# Altium schematic sheet SOURCE_POWER.SchDoc
size A3; SheetNumber: 5; SheetTotal: 12
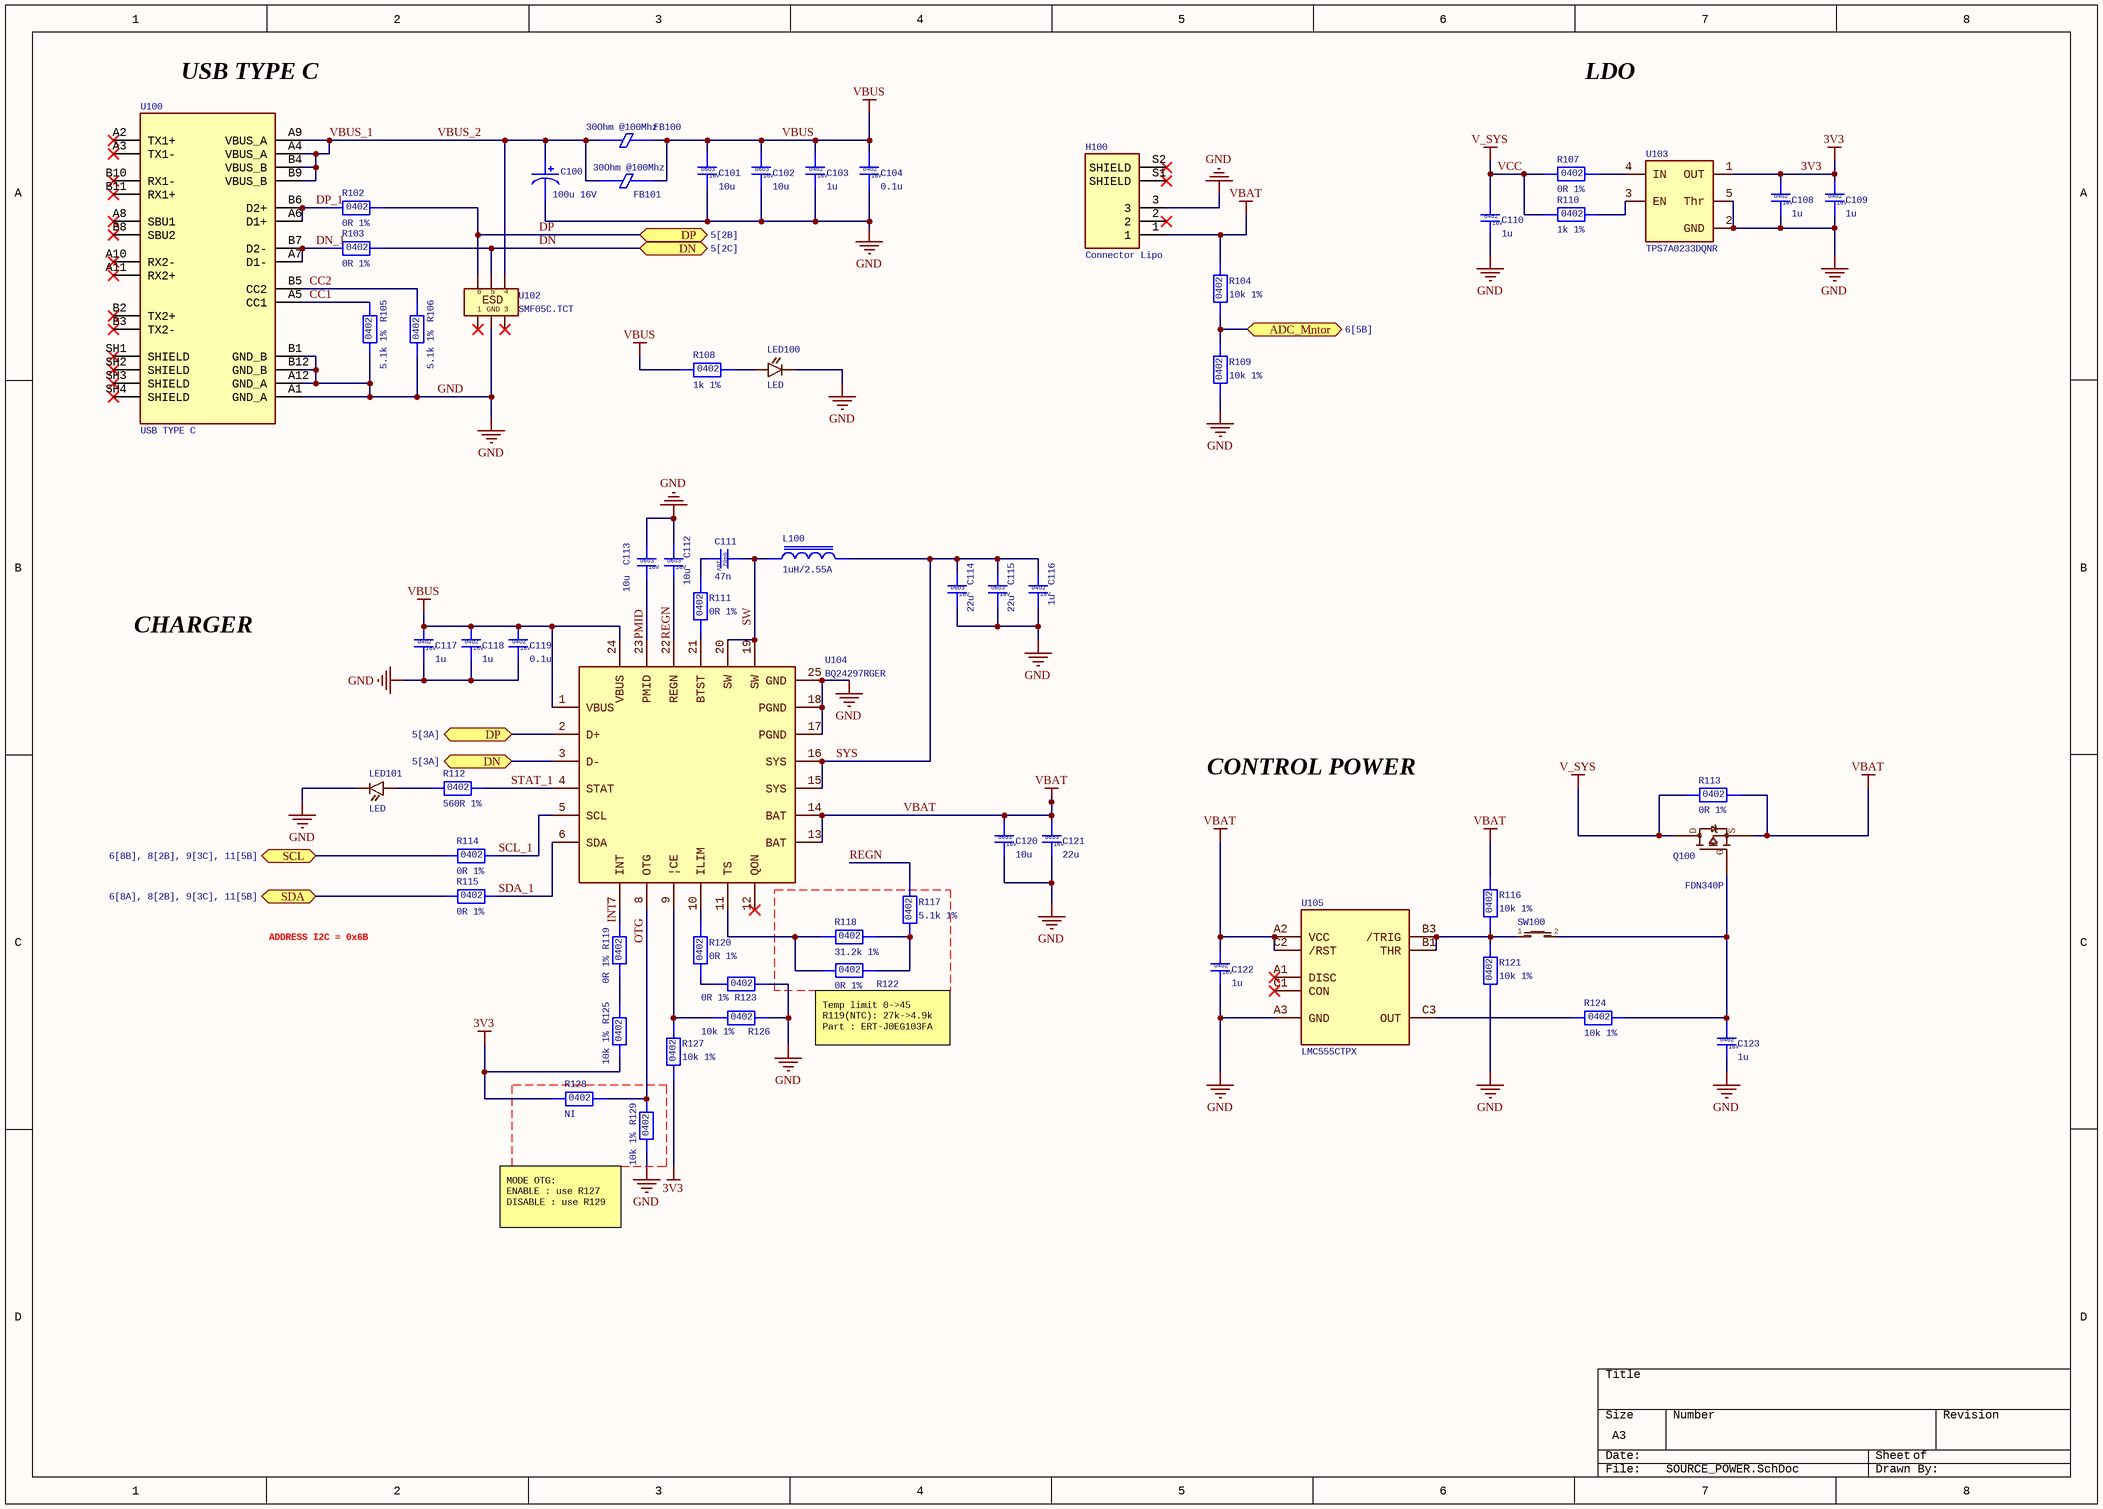
[diagram p0: SOURCE_POWER.SchDoc]

## Parts
C100  100u 16V  [T491C107K016AT]
C101  10u  [CAP0603]
C102  10u  [CAP0603]
C103  1u  [CAP0402]
C104  0.1u  [CAP0402]
C108  1u  [CAP0402]
C109  1u  [CAP0402]
C110  1u  [CAP0402]
C111  47n  [CAP0402]
C112  10u  [CAP0603]
C113  10u  [CAP0603]
C114  22u  [CAP0603]
C115  22u  [CAP0603]
C116  1u  [CAP0402]
C117  1u  [CAP0402]
C118  1u  [CAP0402]
C119  0.1u  [CAP0402]
C120  10u  [CAP0603]
C121  22u  [CAP0603]
C122  1u  [CAP0402]
C123  1u  [CAP0402]
FB100  30Ohm @100Mhz  [FB0402]
FB101  30Ohm @100Mhz  [FB0402]
H100  Connector Lipo  [CON]
L100  1uH/2.55A  [VLS2012ET-1R0N-CA]
LED100  LED  [LED0402]
LED101  LED  [LED0402]
Q100  FDN340P  [FDN340P]
R102  0R 1%  [RES0402]
R103  0R 1%  [RES0402]
R104  10k 1%  [R0402]
R105  5.1k 1%  [RES0402]
R106  5.1k 1%  [RES0402]
R107  0R 1%  [RES0402]
R108  1k 1%  [RES0402]
R109  10k 1%  [R0402]
R110  1k 1%  [RES0402]
R111  0R 1%  [RES0402]
R112  560R 1%  [R0402]
R113  0R 1%  [RES0402]
R114  0R 1%  [RES0402]
R115  0R 1%  [RES0402]
R116  10k 1%  [R0402]
R117  5.1k 1%  [RES0402]
R118  31.2k 1%  [RES0402]
R119  0R 1%  [RES0402]
R120  0R 1%  [RES0402]
R121  10k 1%  [R0402]
R122  0R 1%  [RES0402]
R123  0R 1%  [RES0402]
R124  10k 1%  [R0402]
R125  10k 1%  [R0402]
R126  10k 1%  [R0402]
R127  10k 1%  [R0402]
R128  NI  [RES0402]
R129  10k 1%  [R0402]
SW100  SW  [434331013822]  (value not drawn)
U100  USB TYPE C  [12401826E412A]
U102  SMF05C.TCT  [SMF05C.TCT]
U103  TPS7A0233DQNR  [TPS7A0218PDQNR]
U104  BQ24297RGER  [BQ24297RGER]
U105  LMC555CTPX  [LMC555CTPX/NOPB]

## Ports
ADC_Mntor (bidir, see 6[5B]), DN (bidir, see 5[2C]), DN (bidir, see 5[3A]), DP (bidir, see 5[2B]), DP (bidir, see 5[3A]), SCL (bidir, see 6[8B], 8[2B], 9[3C], 11[5B]), SDA (bidir, see 6[8A], 8[2B], 9[3C], 11[5B])

## Nets
3V3: C108.1 C109.1 R125.1 R127.1 R128.1 U103.1(OUT)
GND: C100.C C101.2 C102.2 C103.2 C104.2 C108.2 C109.2 C110.2 C112.1 C113.1 C114.2 C115.2 C116.2 C117.2 C118.2 C119.2 C120.2 C121.2 C122.2 C123.2 H100.3 LED100.1(C) LED101.1(C) R105.1 R106.1 R109.1 R121.1 R123.2 R126.2 R129.1 U100.A1(GND_A) U100.A12(GND_A) U100.B1(GND_B) U100.B12(GND_B) U102.2 U103.2(GND) U103.5(Thr) U104.17(PGND) U104.18(PGND) U104.25(GND) U105.A3(GND)
VBAT: C120.1 C121.1 C122.1 H100.1 Q100.2(S) R104.2 R113.2 R116.2 U104.13(BAT) U104.14(BAT) U105.A2(VCC) U105.C2(/RST)
VBUS: C101.1 C102.1 C103.1 C104.1 C117.1 C118.1 C119.1 FB100.2 FB101.2 R108.1 U104.1(VBUS) U104.24(VBUS)
VCC: C110.1 Q100.3(D) R107.1 R110.1 R113.1  [also labelled V_SYS]
ADC_Mntor: R104.1 R109.2 ; port ADC_Mntor
CC1: R105.2 U100.A5(CC1)
CC2: R106.2 U100.B5(CC2)
DN: R103.2 U102.5 U104.3(D-) ; port DN
DN_1: R103.1 U100.A7(D1-) U100.B7(D2-)
DP: R102.2 U102.6 U104.2(D+) ; port DP
DP_1: R102.1 U100.A6(D1+) U100.B6(D2+)
INT: R119.2 U104.7(INT)
OTG: R128.2 R129.2 U104.8(OTG)
PMID: C113.2 U104.23(PMID)
REGN: C112.2 R117.2 U104.22(REGN)
SCL: R114.1 ; port SCL
SCL_1: R114.2 U104.5(SCL)
SDA: R115.1 ; port SDA
SDA_1: R115.2 U104.6(SDA)
STAT_1: R112.2 U104.4(STAT)
SW: C111.1 L100.1 U104.19(SW) U104.20(SW)
SYS: C114.1 C115.1 C116.1 L100.2 U104.15(SYS) U104.16(SYS)
VBUS_1: C100.A FB100.1 FB101.1 U100.A4(VBUS_A) U100.A9(VBUS_A) U100.B4(VBUS_B) U100.B9(VBUS_B) U102.4  [also labelled VBUS_2]
NetC111_2: C111.2 R111.2
NetC123_1: C123.1 Q100.1(G) R124.2 SW100.2
NetLED100_2: LED100.2(A) R108.2
NetLED101_2: LED101.2(A) R112.1
NetR107_2: R107.2 U103.4(IN)
NetR110_2: R110.2 U103.3(EN)
NetR111_1: R111.1 U104.21(BTST)
NetR116_1: R116.1 R121.2 SW100.1 U105.B1(THR) U105.B3(/TRIG)
NetR117_1: R117.1 R118.2 R122.2
NetR118_1: R118.1 R122.1 U104.11(TS)
NetR119_1: R119.1 R125.2
NetR120_1: R120.1 R123.1
NetR120_2: R120.2 U104.10(ILIM)
NetR124_1: R124.1 U105.C3(OUT)
NetR126_1: R126.1 R127.2 U104.9(|CE)

Not connected (* = marked no-connect by the designer): H100 2* S1(SHIELD)* S2(SHIELD)*; U100 A2(TX1+)* A3(TX1-)* A8(SBU1)* A10(RX2-)* A11(RX2+)* B2(TX2+)* B3(TX2-)* B8(SBU2)* B10(RX1-)* B11(RX1+)* SH1(SHIELD)* SH2(SHIELD)* SH3(SHIELD)* SH4(SHIELD)*; U102 1* 3*; U104 12(QON)*; U105 A1(DISC)* C1(CON)*

## Notes on the sheet
- USB TYPE C
- LDO
- CHARGER
- CONTROL POWER
- ADDRESS I2C = 0x6B
- (near R122) Temp limit 0->45
  R119(NTC): 27k->4.9k
  Part : ERT-J0EG103FA
- (near R129) MODE OTG:
  ENABLE : use R127
  DISABLE : use R129
- (in symbol R_0402_31.2k) 0402
- (in symbol SMF05C.TCT) ESD; GND

## Library data of the parts
C100 = T491C107K016AT: Tantalum Capacitor, Polarized, Tantalum (dry/solid), 16V, 10% +Tol, 10% -Tol, 100uF, Surface Mount, 2413; Manufacturer: KEMET; ESR (Equivalent Series Resistance): 1R; Leakage Current: 16uA; Ripple Current: 132.8mA; Tan Delta: 0.1; Supplier 1: Digikey; Supplier Part Number 1: 399-5214-1-ND; Supplier: Digikey; Supplier Part Number: 399-5214-1-ND; Manufacturer Part Number: T491C107K016AT; RoHS: Yes; Category: Tantalum Capacitors; Stock: 21248; Pricing: 1=1.86, 10=1.393, 50=1.271, 100=1.0412 (USD); Mounting Technology: Surface Mount; Pins: 2; Terminal Finish: Tin; Dielectric Material: Tantalum; Case/Package: 2413; Package Shape: Rectangular; Min Operating Temperature: -55°C; Max Operating Temperature: 125°C; JESD-609 Code: e3; Package Style: SMTMeter; Packaging: Tape and Reel; Polarity: Polarized; Value: 100uF; Capacitor Type: Tantalum; Tolerance  (fill in as +-): 10%; Tolerance (fill in as +-): 10%; Rated DC Voltage (URdc): 16V; Termination: J BEND; Length: 6mm; Width: 3.2mm; Height: 2.5mm; Reach SVHC Compliant: Yes; RoHS Compliant: Yes; ComponentLink1URL: https://datasheet.ciiva.com:443/pdfs/VipMasterIC/IC/KEME/KEME-S-A0009553711/KEME-S-A0009553711-1.pdf?src-supplier=IHS+Markit; ComponentLink1Description: https://datasheet.ciiva.com:443/pdfs/VipMasterIC/IC/KEME/KEME-S-A0009553711/KEME-S-A0009553711-1.pdf?src-supplier=IHS+Markit; ComponentLink2URL: https://datasheet.ciiva.com/12887/kem-t2005-t491-12887095.pdf?src-supplier=Mouser; ComponentLink2Description: https://datasheet.ciiva.com/12887/kem-t2005-t491-12887095.pdf?src-supplier=Mouser; ComponentLink3URL: https://datasheet.ciiva.com/46417/1854511-46417622.pdf?src-supplier=Element14; ComponentLink3Description: https://datasheet.ciiva.com/46417/1854511-46417622.pdf?src-supplier=Element14; ComponentLink4URL: https://datasheet.ciiva.com/46417/1854511-46417623.pdf?src-supplier=Element14; ComponentLink4Description: https://datasheet.ciiva.com/46417/1854511-46417623.pdf?src-supplier=Element14; ComponentLink5URL: https://datasheet.ciiva.com/46417/1854511-46417624.pdf?src-supplier=Element14; ComponentLink5Description: https://datasheet.ciiva.com/46417/1854511-46417624.pdf?src-supplier=Element14; ComponentLink6URL: https://datasheet.ciiva.com/7614/kem-t2005-t491-7614509.pdf?src-supplier=Digikey; ComponentLink6Description: https://datasheet.ciiva.com/7614/kem-t2005-t491-7614509.pdf?src-supplier=Digikey; ComponentLink7URL: https://datasheet.ciiva.com/7614/kem-t2005-t491-7614510.pdf?src-supplier=Digikey; ComponentLink7Description: https://datasheet.ciiva.com/7614/kem-t2005-t491-7614510.pdf?src-supplier=Digikey; ComponentLink8URL: https://datasheet.ciiva.com/7614/kem-t2005-t491-7614511.pdf?src-supplier=Digikey; ComponentLink8Description: https://datasheet.ciiva.com/7614/kem-t2005-t491-7614511.pdf?src-supplier=Digikey
C101 C102 C112 C113 C120 = C_0402_10u: Ceramic Capacitor, Multilayer, Ceramic, 16V, 20% +Tol, 20% -Tol, X5R, 15% TC, 10uF, Surface Mount, 0603; Manufacturer: Murata; Manufacturer Part Number: GRT188R61C106ME13D; Multilayer: Yes; Reference Standard: AEC-Q200; Supplier: Digikey; Supplier Part Number: 490-12318-1-ND; RoHS: Yes; Category: Ceramic Capacitors; Stock: 232325; Pricing: 1=0.24, 10=0.158, 50=0.1162, 100=0.0947, 500=0.07476, 1000=0.06313 (USD); Mounting Technology: Surface Mount; Pins: 2; Dielectric Material: Ceramic; Package Shape: Rectangular; Case/Package: 0603; Terminal Finish: Nickel; Min Operating Temperature: -55°C; Max Operating Temperature: 85°C; JESD-609 Code: e3; Value: 10uF; Capacitor Type: Ceramic; Tolerance  (fill in as +-): 20%; Packaging: Tape and Reel; Tolerance (fill in as +-): 20%; Rated DC Voltage (URdc): 16V; Temperature Characteristics Code: X5R; Termination: Wraparound; Reach SVHC Compliant: Yes; RoHS Compliant: Yes; ComponentLink1URL: https://datasheet.ciiva.com:443/pdfs/VipMasterIC/IC/MURE/MURE-S-A0004410517/MURE-S-A0004413840-1.pdf?src-supplier=IHS+Markit; ComponentLink1Description: https://datasheet.ciiva.com:443/pdfs/VipMasterIC/IC/MURE/MURE-S-A0004410517/MURE-S-A0004413840-1.pdf?src-supplier=IHS+Markit; ComponentLink2URL: http://search.murata.co.jp/Ceramy/image/img/A01X/G101/ENG/GRT188R61C106ME13-01.pdf?src-supplier=Digikey; ComponentLink2Description: http://search.murata.co.jp/Ceramy/image/img/A01X/G101/ENG/GRT188R61C106ME13-01.pdf?src-supplier=Digikey
C103 C108-C110 C116-C118 C122 C123 = C_0402_1u: Ceramic Capacitor, Multilayer, Ceramic, 16V, 10% +Tol, 10% -Tol, X5R, 15% TC, 1uF, Surface Mount, 0402; Manufacturer: Taiyo Yuden; Manufacturer Part Number: EMK105BJ105KV-F; Multilayer: Yes; Supplier: Digikey; Supplier Part Number: 587-2477-1-ND; RoHS: Yes; Category: Ceramic Capacitors; Stock: 2709915; Pricing: 1=0.1, 10=0.045, 50=0.031, 100=0.0266, 500=0.01912, 1000=0.01682, 2500=0.01437, 5000=0.01289 (USD); Mounting Technology: Surface Mount; Pins: 2; Dielectric Material: Ceramic; Package Shape: Rectangular; Case/Package: 0402; Terminal Finish: Nickel; Min Operating Temperature: -55°C; Max Operating Temperature: 85°C; JESD-609 Code: e3; Value: 1uF; Capacitor Type: Ceramic; Tolerance  (fill in as +-): 10%; Package Style: SMTMeter; Packaging: Tape and Reel; Tolerance (fill in as +-): 10%; Rated DC Voltage (URdc): 16V; Temperature Characteristics Code: X5R; Termination: Wraparound; Length: 1mm; Width: 0.5mm; Height: 0.5mm; Reach SVHC Compliant: Yes; RoHS Compliant: Yes; ComponentLink1URL: https://datasheet.ciiva.com:443/pdfs/VipMasterIC/IC/TAIY/TAIY-S-A0009096450/TAIY-S-A0009096597-1.pdf?src-supplier=IHS+Markit; ComponentLink1Description: https://datasheet.ciiva.com:443/pdfs/VipMasterIC/IC/TAIY/TAIY-S-A0009096450/TAIY-S-A0009096597-1.pdf?src-supplier=IHS+Markit; ComponentLink2URL: https://datasheet.ciiva.com/134/emk105bj105kv-f-ss-134209.pdf?src-supplier=Digikey; ComponentLink2Description: https://datasheet.ciiva.com/134/emk105bj105kv-f-ss-134209.pdf?src-supplier=Digikey; ComponentLink3URL: https://datasheet.ciiva.com/15920/964emk105bj105kv-f-15920402.pdf?src-supplier=Onlinecomponents.com; ComponentLink3Description: https://datasheet.ciiva.com/15920/964emk105bj105kv-f-15920402.pdf?src-supplier=Onlinecomponents.com; ComponentLink4URL: https://datasheet.ciiva.com/26871/getdatasheetpartid-638287-26871289.pdf?src-supplier=Verical; ComponentLink4Description: https://datasheet.ciiva.com/26871/getdatasheetpartid-638287-26871289.pdf?src-supplier=Verical; ComponentLink5URL: https://datasheet.ciiva.com/30259/265emk105bj105kv-f-30259872.pdf?src-supplier=Onlinecomponents.com; ComponentLink5Description: https://datasheet.ciiva.com/30259/265emk105bj105kv-f-30259872.pdf?src-supplier=Onlinecomponents.com; ComponentLink6URL: https://datasheet.ciiva.com/7657/1497285-7657320.pdf?src-supplier=Element14; ComponentLink6Description: https://datasheet.ciiva.com/7657/1497285-7657320.pdf?src-supplier=Element14; ComponentLink7URL: https://datasheet.ciiva.com/22694/1497285-22694239.pdf?src-supplier=Element14; ComponentLink7Description: https://datasheet.ciiva.com/22694/1497285-22694239.pdf?src-supplier=Element14; ComponentLink8URL: https://datasheet.ciiva.com/5424/mlcc01-e-5424190.pdf?src-supplier=Mouser; ComponentLink8Description: https://datasheet.ciiva.com/5424/mlcc01-e-5424190.pdf?src-supplier=Mouser
C104 C119 = C_0402_0.1u: Ceramic Capacitor, Multilayer, Ceramic, 16V, 10% +Tol, 10% -Tol, X7R, 15% TC, 0.1uF, Surface Mount, 0402; Manufacturer: Murata; Manufacturer Part Number: GRM155R71C104KA88J; Value: 100nF; Multilayer: Yes; Supplier: Digikey; Supplier Part Number: 490-6328-1-ND; RoHS: Yes; Category: Ceramic Capacitors; Stock: 19409569; Pricing: 1=0.1, 10=0.019, 50=0.011, 100=0.0086, 500=0.00646, 1000=0.00508, 2500=0.00462, 5000=0.00425 (USD); Mounting Technology: Surface Mount; Pins: 2; Dielectric Material: Ceramic; Package Shape: Rectangular; Case/Package: 0402; Terminal Finish: Nickel; Min Operating Temperature: -55°C; Max Operating Temperature: 125°C; JESD-609 Code: e3; Capacitor Type: Ceramic; Tolerance  (fill in as +-): 10%; Package Style: SMTMeter; Packaging: Tape and Reel; Tolerance (fill in as +-): 10%; Rated DC Voltage (URdc): 16V; Temperature Characteristics Code: X7R; Termination: Wraparound; Length: 1mm; Width: 0.5mm; Height: 0.5mm; Reach SVHC Compliant: Yes; RoHS Compliant: Yes; ComponentLink1URL: https://psearch.en.murata.com:443/capacitor/product/GRM155R71C104KA88%23.pdf?src-supplier=IHS+Markit; ComponentLink1Description: https://psearch.en.murata.com:443/capacitor/product/GRM155R71C104KA88%23.pdf?src-supplier=IHS+Markit; ComponentLink2URL: https://datasheet.ciiva.com/6271/product-6271168.pdf?src-supplier=Digikey; ComponentLink2Description: https://datasheet.ciiva.com/6271/product-6271168.pdf?src-supplier=Digikey; ComponentLink3URL: https://datasheet.ciiva.com/6271/grm155r71c104ka88-01-6271231.pdf?src-supplier=Digikey; ComponentLink3Description: https://datasheet.ciiva.com/6271/grm155r71c104ka88-01-6271231.pdf?src-supplier=Digikey
C111 = C_0402_47n: Ceramic Capacitor, Multilayer, Ceramic, 16V, 10% +Tol, 10% -Tol, X7R, 15% TC, 0.047uF, Surface Mount, 0402; Manufacturer: Murata; Manufacturer Part Number: GCM155R71C473KA37D; Value: 47nF; Multilayer: Yes; Reference Standard: AEC-Q200; Supplier: Digikey; Supplier Part Number: 490-6042-1-ND; RoHS: Yes; Category: Ceramic Capacitors; Stock: 703056; Pricing: 1=0.1, 10=0.031, 50=0.018, 100=0.0139, 500=0.01046, 1000=0.00821, 2500=0.00747, 5000=0.00687 (USD); Mounting Technology: Surface Mount; Pins: 2; Dielectric Material: Ceramic; Package Shape: Rectangular; Case/Package: 0402; Terminal Finish: Nickel; Min Operating Temperature: -55°C; Max Operating Temperature: 125°C; JESD-609 Code: e3; Capacitor Type: Ceramic; Tolerance  (fill in as +-): 10%; Package Style: SMTMeter; Packaging: Tape and Reel; Tolerance (fill in as +-): 10%; Rated DC Voltage (URdc): 16V; Temperature Characteristics Code: X7R; Termination: Wraparound; Length: 1mm; Width: 0.5mm; Height: 0.55mm; Reach SVHC Compliant: Yes; RoHS Compliant: Yes; ComponentLink1URL: https://datasheet.ciiva.com:443/pdfs/VipMasterIC/IC/MURE/MURE-S-A0004370842/MURE-S-A0004373024-1.pdf?src-supplier=IHS+Markit; ComponentLink1Description: https://datasheet.ciiva.com:443/pdfs/VipMasterIC/IC/MURE/MURE-S-A0004370842/MURE-S-A0004373024-1.pdf?src-supplier=IHS+Markit; ComponentLink2URL: https://datasheet.ciiva.com/11607/product-11607786.pdf?src-supplier=Avnet; ComponentLink2Description: https://datasheet.ciiva.com/11607/product-11607786.pdf?src-supplier=Avnet; ComponentLink3URL: https://datasheet.ciiva.com/6270/s0717e-6270764.pdf?src-supplier=Digikey; ComponentLink3Description: https://datasheet.ciiva.com/6270/s0717e-6270764.pdf?src-supplier=Digikey; ComponentLink4URL: https://datasheet.ciiva.com/6270/s0717e-6270765.pdf?src-supplier=Digikey; ComponentLink4Description: https://datasheet.ciiva.com/6270/s0717e-6270765.pdf?src-supplier=Digikey; ComponentLink5URL: https://datasheet.ciiva.com/6270/s0717e-6270766.pdf?src-supplier=Digikey; ComponentLink5Description: https://datasheet.ciiva.com/6270/s0717e-6270766.pdf?src-supplier=Digikey
C114 C115 C121 = C_0402_22u: Ceramic Capacitor, Multilayer, Ceramic, 16V, 20% +Tol, 20% -Tol, X5R, 15% TC, 22uF, Surface Mount, 0603; Manufacturer: Samsung; Manufacturer Part Number: CL10A226MO7JZNC; Multilayer: Yes; Supplier: Digikey; Supplier Part Number: 1276-7076-1-ND; RoHS: Yes; Category: Ceramic Capacitors; Stock: 1046811; Pricing: 1=0.59, 10=0.398, 50=0.3164, 100=0.2614, 500=0.20418, 1000=0.17355, 4000=0.15314, 8000=0.14293, 12000=0.14038, 28000=0.13782 (USD); Mounting Technology: Surface Mount; Pins: 2; Dielectric Material: Ceramic; Package Shape: Rectangular; Case/Package: 0603; Min Operating Temperature: -55°C; Max Operating Temperature: 85°C; Value: 22uF; Capacitor Type: Ceramic; Tolerance  (fill in as +-): 20%; Packaging: Tape and Reel; Tolerance (fill in as +-): 20%; Rated DC Voltage (URdc): 16V; Temperature Characteristics Code: X5R; Termination: Wraparound; Reach SVHC Compliant: Yes; RoHS Compliant: Yes; ComponentLink1URL: https://datasheet.ciiva.com:443/pdfs/VipMasterIC/IC/SEMS/SEMS-S-A0008524842/SEMS-S-A0008524715-1.pdf?src-supplier=IHS+Markit; ComponentLink1Description: https://datasheet.ciiva.com:443/pdfs/VipMasterIC/IC/SEMS/SEMS-S-A0008524842/SEMS-S-A0008524715-1.pdf?src-supplier=IHS+Markit; ComponentLink2URL: http://www.samsungsem.com/kr/support/product-search/mlcc/CL10A226MO7JZNC.jsp?src-supplier=Digikey; ComponentLink2Description: http://www.samsungsem.com/kr/support/product-search/mlcc/CL10A226MO7JZNC.jsp?src-supplier=Digikey; ComponentLink3URL: https://datasheet.octopart.com/CL10A226MO7JZNC-Samsung-Electro-Mechanics-datasheet-149156497.pdf?src-supplier=Future+Electronics; ComponentLink3Description: https://datasheet.octopart.com/CL10A226MO7JZNC-Samsung-Electro-Mechanics-datasheet-149156497.pdf?src-supplier=Future+Electronics
FB100 FB101 = BLM15PD300SN1D: Ferrite Chip, 1 Function(s), 1.4A, 2 Pin(s); Manufacturer: Murata; DC Resistance-Max: 35mR; Clock Frequency: 100MHz; Channels: 1; Output Impedance: 30R; Supplier 1: Digikey; Supplier Part Number 1: 490-5200-1-ND; Supplier: Digikey; Supplier Part Number: 490-5200-6-ND; Manufacturer Part Number: BLM15PD300SN1D; RoHS: Yes; Category: Ferrite Beads and Chips; Stock: 1685; Pricing: 1=0.1, 10=0.054, 25=0.0468, 50=0.042, 100=0.0376, 250=0.03236, 500=0.02884, 1000=0.02561, 5000=0.01905 (USD); Mounting Technology: Surface Mount; Material: Ferrite; Case Code: 0402; Terminal Finish: Tin; Min Operating Temperature: -55°C; Max Operating Temperature: 125°C; JESD-609 Code: e3; Construction: Chip Bead; Filter Type: FERRITE CHIP; Min Frequency: 100MHz; Packaging: Tape and Reel; Current Rating: 1.4A; Length: 1mm; Width: 0.5mm; Height: 0.5mm; Reach SVHC Compliant: Yes; RoHS Compliant: Yes; ComponentLink1URL: https://datasheet.ciiva.com:443/pdfs/VipMasterIC/IC/MURE/MURE-S-A0010009827/MURE-S-A0010009827-1.pdf?src-supplier=IHS+Markit; ComponentLink1Description: https://datasheet.ciiva.com:443/pdfs/VipMasterIC/IC/MURE/MURE-S-A0010009827/MURE-S-A0010009827-1.pdf?src-supplier=IHS+Markit; ComponentLink2URL: https://datasheet.ciiva.com/3854/l0110s0100blm15p-3854117.pdf?src-supplier=Arrow+Electronics; ComponentLink2Description: https://datasheet.ciiva.com/3854/l0110s0100blm15p-3854117.pdf?src-supplier=Arrow+Electronics; ComponentLink3URL: https://datasheet.ciiva.com/18093/getdatasheetpartid-150173-18093043.pdf?src-supplier=Verical; ComponentLink3Description: https://datasheet.ciiva.com/18093/getdatasheetpartid-150173-18093043.pdf?src-supplier=Verical; ComponentLink4URL: https://datasheet.ciiva.com/41425/001171687-da-01-en-chip-drossel0402-30r-2200ma-1-0x0-5mm-41425790.pdf?src-supplier=Conrad; ComponentLink4Description: https://datasheet.ciiva.com/41425/001171687-da-01-en-chip-drossel0402-30r-2200ma-1-0x0-5mm-41425790.pdf?src-supplier=Conrad; ComponentLink5URL: https://datasheet.ciiva.com/41449/001172206-da-01-en-drossel-0402-30r-21-0x0-5mm-10000st-41449493.pdf?src-supplier=Conrad; ComponentLink5Description: https://datasheet.ciiva.com/41449/001172206-da-01-en-drossel-0402-30r-21-0x0-5mm-10000st-41449493.pdf?src-supplier=Conrad; ComponentLink6URL: https://datasheet.ciiva.com/14122/blm-series-eng-tds-14122923.pdf?src-supplier=Distrelec; ComponentLink6Description: https://datasheet.ciiva.com/14122/blm-series-eng-tds-14122923.pdf?src-supplier=Distrelec; ComponentLink7URL: https://datasheet.ciiva.com/1012/l0110e-1012431.pdf?src-supplier=Digikey; ComponentLink7Description: https://datasheet.ciiva.com/1012/l0110e-1012431.pdf?src-supplier=Digikey; ComponentLink8URL: https://datasheet.ciiva.com/1012/l0110e-1012432.pdf?src-supplier=Digikey; ComponentLink8Description: https://datasheet.ciiva.com/1012/l0110e-1012432.pdf?src-supplier=Digikey; ComponentLink9URL: https://datasheet.ciiva.com/1012/l0110e-1012433.pdf?src-supplier=Digikey; ComponentLink9Description: https://datasheet.ciiva.com/1012/l0110e-1012433.pdf?src-supplier=Digikey
H100 = Connector Lipo: CONN HEADER SH 3POS SIDE 1MM TIN; Manufacturer: JST; Manufacturer Part Number: SM03B-SRSS-TB(LF)(SN); Supplier: Farnell; Supplier Part Number: 1679118; RoHS: Yes; Category: Connectors; Stock: 153704; Pricing: 10=0.261, 100=0.194, 500=0.167, 1000=0.148, 2500=0.14, 5000=0.131 (GBP); ComponentLink1URL: https://datasheet.ciiva.com/26894/getdatasheetpartid-708885-26894671.pdf?src-supplier=Verical; ComponentLink1Description: https://datasheet.ciiva.com/26894/getdatasheetpartid-708885-26894671.pdf?src-supplier=Verical; ComponentLink2URL: https://datasheet.ciiva.com/16394/sm03b-srss-tblfsn-16394332.pdf?src-supplier=Future+Electronics; ComponentLink2Description: https://datasheet.ciiva.com/16394/sm03b-srss-tblfsn-16394332.pdf?src-supplier=Future+Electronics; ComponentLink3URL: https://datasheet.ciiva.com/8052/91630-8052263.pdf?src-supplier=Element14; ComponentLink3Description: https://datasheet.ciiva.com/8052/91630-8052263.pdf?src-supplier=Element14
L100 = VLS2012ET-1R0N-CA: FIXED IND 1UH 1.65A 86 MOHM SMD; Supplier 1: Digikey; Supplier Part Number 1: 445-172980-1-ND
LED100 LED101 = LED0402: Single Color LED, Hyper Red, Water Clear, 0.8mm; Manufacturer: Kingbright; Manufacturer Part Number: APHHS1005SURCK; Shape: Rectangular; Forward Current: 30mA; Luminous Intensity-Nom: 140mcd; Channels: 1; Viewing Angle: 120°; Forward Voltage: 2.5V; Reverse Voltage-Max: 5V; Overall Height: 0.5mm; Supplier: Digikey; Supplier Part Number: 754-1104-1-ND; RoHS: Yes; Category: LEDs; Stock: 73220; Pricing: 1=0.47, 10=0.31, 100=0.2068, 500=0.14302, 1000=0.11918 (USD); Mounting Technology: Surface Mount; Pins: 2; Color: Red; Color@wavelength: Red; Min Operating Temperature: -40°C; Max Operating Temperature: 85°C; Lens Style: WATER CLEAR; Optoelectronic Device Type: SINGLE COLOR LED; Packaging: Tape and Reel; Size: 0.8mm; Terminal Pitch: 1.1mm; Reach SVHC Compliant: Yes; RoHS Compliant: Yes; ComponentLink1URL: https://datasheet.ciiva.com:443/pdfs/VipMasterIC/IC/KBEC/KBEC-S-A0008947180/KBEC-S-A0008958151-1.pdf?src-supplier=IHS+Markit; ComponentLink1Description: https://datasheet.ciiva.com:443/pdfs/VipMasterIC/IC/KBEC/KBEC-S-A0008947180/KBEC-S-A0008958151-1.pdf?src-supplier=IHS+Markit; ComponentLink2URL: https://datasheet.ciiva.com/4689/aphhs1005surck-32322-4689068.pdf?src-supplier=Mouser; ComponentLink2Description: https://datasheet.ciiva.com/4689/aphhs1005surck-32322-4689068.pdf?src-supplier=Mouser; ComponentLink3URL: https://datasheet.ciiva.com/2114/aphhs1005surck-2114140.pdf?src-supplier=Digikey; ComponentLink3Description: https://datasheet.ciiva.com/2114/aphhs1005surck-2114140.pdf?src-supplier=Digikey; ComponentLink4URL: https://datasheet.ciiva.com/14603/70062833-14603899.pdf?src-supplier=Allied+Electronics; ComponentLink4Description: https://datasheet.ciiva.com/14603/70062833-14603899.pdf?src-supplier=Allied+Electronics; ComponentLink5URL: https://datasheet.ciiva.com/2114/aphhs1005surck-2114141.pdf?src-supplier=Digikey; ComponentLink5Description: https://datasheet.ciiva.com/2114/aphhs1005surck-2114141.pdf?src-supplier=Digikey; ComponentLink6URL: https://datasheet.ciiva.com/2114/aphhs1005surck-2114142.pdf?src-supplier=Digikey; ComponentLink6Description: https://datasheet.ciiva.com/2114/aphhs1005surck-2114142.pdf?src-supplier=Digikey
Q100 = FDN340P: Small Signal Field-Effect Transistor, 2A I(D), 20V, 1-Element, P-Channel, Silicon, Metal-oxide Semiconductor FET; Manufacturer: ON Semiconductor / Fairchild; Package Body Material: Plastic; Number of Elements: 1; Drain-source On Resistance-Max: 70R; Operating Mode: ENHANCEMENT MODE; Power Dissipation-Max (Abs): 500mW; Transistor Application: SWITCHING; Qualification Status: Not Qualified; Supplier 1: Digikey; Supplier Part Number 1: FDN340PCT-ND; Supplier: Digikey; Supplier Part Number: FDN340PCT-ND; Manufacturer Part Number: FDN340P; RoHS: Yes; Category: MOSFETs; Stock: 82276; Pricing: 1=0.46, 10=0.355, 100=0.213, 500=0.1972, 1000=0.1341, 3000=0.12345, 6000=0.11832, 9000=0.10649, 30000=0.10491, 75000=0.0986 (USD); Pins: 3; Package Shape: Rectangular; Transistor Element Material: SILICON; Terminal Finish: Tin; Max Operating Temperature: 150°C; JESD-30 Code: R-PDSO-G3; Moisture Sensitivity Level: 1; Package Style: SMALL OUTLINEMeter; Surface Mount: Yes; Terminal Form: Gull Wing; Terminal Position: DUAL; Polarity/Channel Type: P-CHANNEL; Drain Current-Max (Abs) (ID): 2A; Drain Current-Max (ID): 2A; DS Breakdown Voltage-Min: 20V; FET Technology: METAL-OXIDE SEMICONDUCTOR; JESD-609 Code: e3; Reach SVHC Compliant: Yes; RoHS Compliant: Yes; ComponentLink1URL: https://datasheet.ciiva.com:443/pdfs/VipMasterIC/IC/ONSM/ONSM-S-A0003584711/ONSM-S-A0003584686-1.pdf?src-supplier=IHS+Markit; ComponentLink1Description: https://datasheet.ciiva.com:443/pdfs/VipMasterIC/IC/ONSM/ONSM-S-A0003584711/ONSM-S-A0003584686-1.pdf?src-supplier=IHS+Markit
R102 R103 R107 R111 R113-R115 R119 R120 R122 R123 = R_0402_0R: Metal Glaze/thick Film, 0.0625W, 0ohm, Surface Mount, 0402; Manufacturer: Yageo; Manufacturer Part Number: RC0402JR-070RL; Power: 62.5mW; Rated Temperature: 70°C; Package Height: 0.35mm; Package Length: 1mm; Package Width: 0.5mm; Supplier 1: Digikey; Supplier Part Number 1: 311-0.0JRTR-ND; Supplier: Digikey; Supplier Part Number: 311-0.0JRCT-ND; RoHS: Yes; Category: Chip SMD Resistors; Stock: 14877447; Pricing: 1=0.1, 10=0.011, 25=0.0084, 50=0.0064, 100=0.0045, 250=0.00364, 500=0.0029, 1000=0.00214, 5000=0.00154, 10000=0.00133, 30000=0.00117, 50000=0.00107, 100000=0.00105 (USD); Mounting Technology: Surface Mount; Pins: 2; Package Shape: Rectangular; Case/Package: 0402; Terminal Finish: Nickel; Min Operating Temperature: -55°C; Max Operating Temperature: 155°C; JESD-609 Code: e3; Resistor Type: FIXED RESISTOR; Packaging: Tape and Reel; Value: 0R; Technology: METAL GLAZE/THICK FILM; Termination: Wraparound; Construction: Chip; Package Style: SMTMeter; Reach SVHC Compliant: Yes; RoHS Compliant: Yes; ComponentLink1URL: https://datasheet.ciiva.com:443/pdfs/VipMasterIC/IC/YAGO/YAGO-S-A0008145938/YAGO-S-A0008145938-1.pdf?src-supplier=IHS+Markit; ComponentLink1Description: https://datasheet.ciiva.com:443/pdfs/VipMasterIC/IC/YAGO/YAGO-S-A0008145938/YAGO-S-A0008145938-1.pdf?src-supplier=IHS+Markit; ComponentLink2URL: https://datasheet.ciiva.com/2452/pyu-rc0402-51-rohs-l-6-2452608.pdf?src-supplier=Digikey; ComponentLink2Description: https://datasheet.ciiva.com/2452/pyu-rc0402-51-rohs-l-6-2452608.pdf?src-supplier=Digikey; ComponentLink3URL: https://datasheet.ciiva.com/11808/0900766b80c66297-11808195.pdf?src-supplier=Rs; ComponentLink3Description: https://datasheet.ciiva.com/11808/0900766b80c66297-11808195.pdf?src-supplier=Rs; ComponentLink4URL: https://datasheet.ciiva.com/7983/1018594-7983535.pdf?src-supplier=Element14; ComponentLink4Description: https://datasheet.ciiva.com/7983/1018594-7983535.pdf?src-supplier=Element14; ComponentLink5URL: https://datasheet.ciiva.com/22747/1018594-22747515.pdf?src-supplier=Element14; ComponentLink5Description: https://datasheet.ciiva.com/22747/1018594-22747515.pdf?src-supplier=Element14; ComponentLink6URL: https://datasheet.ciiva.com/2452/pyu-r-int-thick-7-2452609.pdf?src-supplier=Digikey; ComponentLink6Description: https://datasheet.ciiva.com/2452/pyu-r-int-thick-7-2452609.pdf?src-supplier=Digikey; ComponentLink7URL: https://datasheet.ciiva.com/2452/pyu-r-int-thick-7-2452610.pdf?src-supplier=Digikey; ComponentLink7Description: https://datasheet.ciiva.com/2452/pyu-r-int-thick-7-2452610.pdf?src-supplier=Digikey; ComponentLink8URL: https://datasheet.ciiva.com/8896/pyu-rc0402-51-rohs-l-6-8896201.pdf?src-supplier=Avnet; ComponentLink8Description: https://datasheet.ciiva.com/8896/pyu-rc0402-51-rohs-l-6-8896201.pdf?src-supplier=Avnet
R104 R109 R116 R121 R124-R127 R129 = R_0402_10k: Fixed Resistor, Metal Glaze/thick Film, 0.06W, 10000ohm, 50V, 1% +/-Tol, 100ppm/Cel, Surface Mount, 0402; Manufacturer: Samsung; Manufacturer Part Number: RC1005F103CS; Power: 60mW; Value: 10kR; Temperature Coefficient: 100ppm/°C; Package Height: 0.35mm; Package Length: 1mm; Package Width: 0.5mm; Supplier: Digikey; Supplier Part Number: 1276-3431-1-ND; RoHS: Yes; Category: Chip SMD Resistors; Stock: 14343795; Pricing: 1=0.1, 10=0.024, 50=0.0156, 100=0.0132, 500=0.00922, 1000=0.00803, 5000=0.00598, 10000=0.00533, 20000=0.00481, 30000=0.00458 (USD); Mounting Technology: Surface Mount; Pins: 2; Package Shape: Rectangular; Case/Package: 0402; Terminal Finish: Nickel; Min Operating Temperature: -55°C; Max Operating Temperature: 125°C; Tolerance: 1%; JESD-609 Code: e3; Resistor Type: FIXED RESISTOR; Construction: Chip; Package Style: SMTMeter; Packaging: Tape and Reel; Technology: METAL GLAZE/THICK FILM; Working Voltage: 50V; Reach SVHC Compliant: Yes; RoHS Compliant: Yes; ComponentLink1URL: https://datasheet.ciiva.com:443/pdfs/VipMasterIC/IC/SEMS/SEMS-S-A0001326806/SEMS-S-A0001326806-1.pdf?src-supplier=IHS+Markit; ComponentLink1Description: https://datasheet.ciiva.com:443/pdfs/VipMasterIC/IC/SEMS/SEMS-S-A0001326806/SEMS-S-A0001326806-1.pdf?src-supplier=IHS+Markit; ComponentLink2URL: https://datasheet.ciiva.com/15196/getdatasheetpartid-504789-15196214.pdf?src-supplier=Verical; ComponentLink2Description: https://datasheet.ciiva.com/15196/getdatasheetpartid-504789-15196214.pdf?src-supplier=Verical; ComponentLink3URL: https://datasheet.ciiva.com/16481/rcseries-16481007.pdf?src-supplier=Future+Electronics; ComponentLink3Description: https://datasheet.ciiva.com/16481/rcseries-16481007.pdf?src-supplier=Future+Electronics
R105 R106 R117 = R_0402_5.1k: Fixed Resistor, Metal Glaze/thick Film, 0.0625W, 5100ohm, 50V, 1% +/-Tol, 100ppm/Cel, Surface Mount, 0402; Manufacturer: Yageo; Manufacturer Part Number: RC0402FR-075K1L; Additional Feature: LASER TRIMMABLE; Power: 62.5mW; Rated Temperature: 70°C; Value: 5.1kR; Temperature Coefficient: 100ppm/°C; Package Height: 0.35mm; Package Length: 1mm; Package Width: 0.5mm; Supplier: Digikey; Supplier Part Number: 311-5.10KLRCT-ND; RoHS: Yes; Category: Chip SMD Resistors; Stock: 302088; Pricing: 1=0.1, 10=0.015, 50=0.0088, 100=0.0073, 500=0.00488, 1000=0.00417, 5000=0.00297 (USD); Mounting Technology: Surface Mount; Pins: 2; Package Shape: Rectangular; Case/Package: 0402; Terminal Finish: Nickel; Min Operating Temperature: -55°C; Max Operating Temperature: 155°C; Tolerance: 1%; JESD-609 Code: e3; Resistor Type: FIXED RESISTOR; Packaging: Tape and Reel; Technology: METAL GLAZE/THICK FILM; Termination: Wraparound; Working Voltage: 50V; Construction: Chip; Package Style: SMTMeter; Reach SVHC Compliant: Yes; RoHS Compliant: Yes; ComponentLink1URL: https://datasheet.ciiva.com:443/pdfs/VipMasterIC/IC/YAGO/YAGO-S-A0008145938/YAGO-S-A0008145938-1.pdf?src-supplier=IHS+Markit; ComponentLink1Description: https://datasheet.ciiva.com:443/pdfs/VipMasterIC/IC/YAGO/YAGO-S-A0008145938/YAGO-S-A0008145938-1.pdf?src-supplier=IHS+Markit; ComponentLink2URL: https://datasheet.ciiva.com/7983/1018594-7983519.pdf?src-supplier=Element14; ComponentLink2Description: https://datasheet.ciiva.com/7983/1018594-7983519.pdf?src-supplier=Element14; ComponentLink3URL: https://datasheet.ciiva.com/46394/1018594-46394936.pdf?src-supplier=Element14; ComponentLink3Description: https://datasheet.ciiva.com/46394/1018594-46394936.pdf?src-supplier=Element14; ComponentLink4URL: https://datasheet.ciiva.com/2453/pyu-r-int-thick-7-2453401.pdf?src-supplier=Digikey; ComponentLink4Description: https://datasheet.ciiva.com/2453/pyu-r-int-thick-7-2453401.pdf?src-supplier=Digikey; ComponentLink5URL: https://datasheet.ciiva.com/2453/pyu-r-int-thick-7-2453402.pdf?src-supplier=Digikey; ComponentLink5Description: https://datasheet.ciiva.com/2453/pyu-r-int-thick-7-2453402.pdf?src-supplier=Digikey; ComponentLink6URL: https://datasheet.ciiva.com/2453/pyu-r-int-thick-7-2453400.pdf?src-supplier=Digikey; ComponentLink6Description: https://datasheet.ciiva.com/2453/pyu-r-int-thick-7-2453400.pdf?src-supplier=Digikey; ComponentLink7URL: https://datasheet.ciiva.com/12558/pyu-rc0402-51-rohs-l-6-r-8721-12558460.pdf?src-supplier=Mouser; ComponentLink7Description: https://datasheet.ciiva.com/12558/pyu-rc0402-51-rohs-l-6-r-8721-12558460.pdf?src-supplier=Mouser; ComponentLink8URL: https://datasheet.ciiva.com/16744/pyu-rc0402-51-rohs-l-6-r-16744283.pdf?src-supplier=Future+Electronics; ComponentLink8Description: https://datasheet.ciiva.com/16744/pyu-rc0402-51-rohs-l-6-r-16744283.pdf?src-supplier=Future+Electronics; ComponentLink9URL: https://datasheet.ciiva.com/15189/getdatasheetpartid-323636-15189493.pdf?src-supplier=Verical; ComponentLink9Description: https://datasheet.ciiva.com/15189/getdatasheetpartid-323636-15189493.pdf?src-supplier=Verical
R108 R110 = R_0402_1k: Fixed Resistor, Metal Glaze/thick Film, 0.1W, 1000ohm, 75V, 1% +/-Tol, 100ppm/Cel, Surface Mount, 0402; Manufacturer: KOA Speer; Manufacturer Part Number: RK73H1ETTP1001F; Additional Feature: PRECISION; Power: 100mW; Rated Temperature: 70°C; Value: 1kR; Temperature Coefficient: 100ppm/°C; Working Voltage: 50V; Package Height: 0.35mm; Package Length: 1mm; Package Width: 0.5mm; Reference Standard: AEC-Q200; Supplier 1: Digikey; Supplier Part Number 1: 311-1.00KLRDKR-ND; Supplier: Digikey; Supplier Part Number: 2019-RK73H1ETTP1001FCT-ND; RoHS: Yes; Category: Chip SMD Resistors; Stock: 1041060; Pricing: 1=0.1, 10=0.021, 50=0.0134, 100=0.0112, 500=0.00764, 1000=0.00658, 5000=0.00478 (USD); Mounting Technology: Surface Mount; Pins: 2; Case/Package: 0402; Terminal Finish: Nickel; Min Operating Temperature: -55°C; Max Operating Temperature: 155°C; Tolerance: 1%; JESD-609 Code: e3; Resistor Type: FIXED RESISTOR; Construction: Rectangular; Package Style: SMTMeter; Packaging: Tape and Reel; Technology: METAL GLAZE/THICK FILM; Termination: Wraparound; Reach SVHC Compliant: Yes; RoHS Compliant: Yes; ComponentLink1URL: https://datasheet.ciiva.com:443/pdfs/VipMasterIC/IC/KOAS/KOAS-S-A0009586304/KOAS-S-A0009586304-1.pdf?src-supplier=IHS+Markit; ComponentLink1Description: https://datasheet.ciiva.com:443/pdfs/VipMasterIC/IC/KOAS/KOAS-S-A0009586304/KOAS-S-A0009586304-1.pdf?src-supplier=IHS+Markit; ComponentLink2URL: https://datasheet.ciiva.com/5554/rk73h-5554172.pdf?src-supplier=Mouser; ComponentLink2Description: https://datasheet.ciiva.com/5554/rk73h-5554172.pdf?src-supplier=Mouser
R112 = R_0402_560R: Fixed Resistor, Metal Glaze/thick Film, 0.1W, 560ohm, 75V, 1% +/-Tol, 100ppm/Cel, Surface Mount, 0402; Manufacturer: KOA Speer; Manufacturer Part Number: RK73H1ETTP5600F; Additional Feature: PRECISION; Power: 100mW; Rated Temperature: 70°C; Temperature Coefficient: 100ppm/°C; Working Voltage: 50V; Package Height: 0.35mm; Package Length: 1mm; Package Width: 0.5mm; Reference Standard: AEC-Q200; Supplier: Digikey; Supplier Part Number: 2019-RK73H1ETTP5600FCT-ND; RoHS: Yes; Category: Chip SMD Resistors; Stock: 65205; Pricing: 1=0.1, 10=0.021, 50=0.0134, 100=0.0112, 500=0.00764, 1000=0.00658, 5000=0.00478 (USD); Mounting Technology: Surface Mount; Pins: 2; Case/Package: 0402; Terminal Finish: Nickel; Min Operating Temperature: -55°C; Max Operating Temperature: 155°C; Tolerance: 1%; JESD-609 Code: e3; Resistor Type: FIXED RESISTOR; Construction: Rectangular; Package Style: SMTMeter; Packaging: Tape and Reel; Value: 560R; Technology: METAL GLAZE/THICK FILM; Termination: Wraparound; Reach SVHC Compliant: Yes; RoHS Compliant: Yes; ComponentLink1URL: https://datasheet.ciiva.com:443/pdfs/VipMasterIC/IC/KOAS/KOAS-S-A0009586304/KOAS-S-A0009586304-1.pdf?src-supplier=IHS+Markit; ComponentLink1Description: https://datasheet.ciiva.com:443/pdfs/VipMasterIC/IC/KOAS/KOAS-S-A0009586304/KOAS-S-A0009586304-1.pdf?src-supplier=IHS+Markit; ComponentLink2URL: https://datasheet.ciiva.com/5557/rk73h-5557917.pdf?src-supplier=Mouser; ComponentLink2Description: https://datasheet.ciiva.com/5557/rk73h-5557917.pdf?src-supplier=Mouser
R118 = R_0402_31.2k: Fixed Resistor, Thin Film, 0.063W, 31200ohm, 50V, 1% +/-Tol, 25ppm/Cel, Surface Mount, 0402; Manufacturer: KOA Speer; Manufacturer Part Number: RN73H1ETTP3122F25; Supplier: Digikey; Supplier Part Number: 2019-RN73H1ETTP3122F25CT-ND; RoHS: Yes; Category: Resistors; Stock: 29267; Pricing: 1=0.25, 10=0.187, 50=0.1462, 100=0.1304, 500=0.09846, 1000=0.08675, 5000=0.0639 (USD); ComponentLink1URL: https://datasheet.ciiva.com:443/pdfs/VipMasterIC/IC/KOAS/KOAS-S-A0009586296/KOAS-S-A0009586296-1.pdf?src-supplier=IHS+Markit; ComponentLink1Description: https://datasheet.ciiva.com:443/pdfs/VipMasterIC/IC/KOAS/KOAS-S-A0009586296/KOAS-S-A0009586296-1.pdf?src-supplier=IHS+Markit; ComponentLink2URL: https://datasheet.ciiva.com/12737/rn73h-12737573.pdf?src-supplier=Mouser; ComponentLink2Description: https://datasheet.ciiva.com/12737/rn73h-12737573.pdf?src-supplier=Mouser
R128 = R_0402_0R: Metal Glaze/thick Film, 0.0625W, 0ohm, Surface Mount, 0402; Manufacturer: Yageo; Manufacturer Part Number: RC0402JR-070RL; Power: 62.5mW; Rated Temperature: 70°C; Value: 0R; Package Height: 0.35mm; Package Length: 1mm; Package Width: 0.5mm; Supplier 1: Digikey; Supplier Part Number 1: 311-0.0JRTR-ND; Supplier: Digikey; Supplier Part Number: 311-0.0JRCT-ND; RoHS: Yes; Category: Chip SMD Resistors; Stock: 14877447; Pricing: 1=0.1, 10=0.011, 25=0.0084, 50=0.0064, 100=0.0045, 250=0.00364, 500=0.0029, 1000=0.00214, 5000=0.00154, 10000=0.00133, 30000=0.00117, 50000=0.00107, 100000=0.00105 (USD); Mounting Technology: Surface Mount; Pins: 2; Package Shape: Rectangular; Case/Package: 0402; Terminal Finish: Nickel; Min Operating Temperature: -55°C; Max Operating Temperature: 155°C; JESD-609 Code: e3; Resistor Type: FIXED RESISTOR; Packaging: Tape and Reel; Technology: METAL GLAZE/THICK FILM; Termination: Wraparound; Construction: Chip; Package Style: SMTMeter; Reach SVHC Compliant: Yes; RoHS Compliant: Yes; ComponentLink1URL: https://datasheet.ciiva.com:443/pdfs/VipMasterIC/IC/YAGO/YAGO-S-A0008145938/YAGO-S-A0008145938-1.pdf?src-supplier=IHS+Markit; ComponentLink1Description: https://datasheet.ciiva.com:443/pdfs/VipMasterIC/IC/YAGO/YAGO-S-A0008145938/YAGO-S-A0008145938-1.pdf?src-supplier=IHS+Markit; ComponentLink2URL: https://datasheet.ciiva.com/2452/pyu-rc0402-51-rohs-l-6-2452608.pdf?src-supplier=Digikey; ComponentLink2Description: https://datasheet.ciiva.com/2452/pyu-rc0402-51-rohs-l-6-2452608.pdf?src-supplier=Digikey; ComponentLink3URL: https://datasheet.ciiva.com/11808/0900766b80c66297-11808195.pdf?src-supplier=Rs; ComponentLink3Description: https://datasheet.ciiva.com/11808/0900766b80c66297-11808195.pdf?src-supplier=Rs; ComponentLink4URL: https://datasheet.ciiva.com/7983/1018594-7983535.pdf?src-supplier=Element14; ComponentLink4Description: https://datasheet.ciiva.com/7983/1018594-7983535.pdf?src-supplier=Element14; ComponentLink5URL: https://datasheet.ciiva.com/22747/1018594-22747515.pdf?src-supplier=Element14; ComponentLink5Description: https://datasheet.ciiva.com/22747/1018594-22747515.pdf?src-supplier=Element14; ComponentLink6URL: https://datasheet.ciiva.com/2452/pyu-r-int-thick-7-2452609.pdf?src-supplier=Digikey; ComponentLink6Description: https://datasheet.ciiva.com/2452/pyu-r-int-thick-7-2452609.pdf?src-supplier=Digikey; ComponentLink7URL: https://datasheet.ciiva.com/2452/pyu-r-int-thick-7-2452610.pdf?src-supplier=Digikey; ComponentLink7Description: https://datasheet.ciiva.com/2452/pyu-r-int-thick-7-2452610.pdf?src-supplier=Digikey; ComponentLink8URL: https://datasheet.ciiva.com/8896/pyu-rc0402-51-rohs-l-6-8896201.pdf?src-supplier=Avnet; ComponentLink8Description: https://datasheet.ciiva.com/8896/pyu-rc0402-51-rohs-l-6-8896201.pdf?src-supplier=Avnet
SW100 = 434331013822: SWITCH TACTILE SPST-NO 0.05A 12V; Supplier 1: Digikey; Supplier Part Number 1: 732-10144-1-ND
U100 = USBC_12401826E412A: USB3.2 GEN2, Type C, Top mount, CH 1.58mm, Dual Row SMT / Tap/Rl RoHS Compliant: Yes; Manufacturer: Amphenol Communications Solutions; Supplier 1: Digikey; Supplier Part Number 1: 12401826E412ACT-ND; Supplier: Digikey; Supplier Part Number: 12401826E412ACT-ND; Manufacturer Part Number: 12401826E412A; RoHS: No; Category: USB Connectors; Stock: 9613; Pricing: 1=2.38, 10=1.813, 25=1.632, 50=1.509, 100=1.3971, 250=1.26484, 500=1.17548 (USD); ComponentLink1URL: https://datasheet.octopart.com/12401826E412A-Amphenol-Communications-Solutions-datasheet-112029729.pdf?src-supplier=Master+Electronics; ComponentLink1Description: https://datasheet.octopart.com/12401826E412A-Amphenol-Communications-Solutions-datasheet-112029729.pdf?src-supplier=Master+Electronics
U102 = SMF05C.TCT: Trans Voltage Suppressor Diode, 100W, 5V V(RWM), Unidirectional, 5 Element, Silicon, MO-203AB; Manufacturer: Semtech; Package Body Material: Plastic; Min Breakdown Voltage: 6V; Clamping Voltage-Max: 12.5V; Number of Elements: 5; Qualification Status: Not Qualified; Supplier 1: Digikey; Supplier Part Number 1: SMF05CCT-ND; Supplier: Digikey; Supplier Part Number: SMF05CCT-ND; Manufacturer Part Number: SMF05C.TCT; RoHS: Yes; Category: TVS Diodes; Stock: 54740; Pricing: 1=0.8, 10=0.689, 100=0.4772, 500=0.39874, 1000=0.33936 (USD); Pins: 6; Diode Element Material: SILICON; Package Shape: Rectangular; Terminal Finish: Tin; Min Operating Temperature: -55°C; Max Operating Temperature: 125°C; JESD-609 Code: e3; Polarity: Unidirectional; Diode Type: TRANS VOLTAGE SUPPRESSOR; JESD-30 Code: R-PDSO-G6; Moisture Sensitivity Level: 1; Non-rep Peak Rev Power Dis-Max: 100W; Package Style: SMALL OUTLINEMeter; Peak Reflow Temperature (Cel): 260°C; Rep Pk Reverse Voltage-Max: 5V; Surface Mount: Yes; Technology: AVALANCHE; Terminal Form: Gull Wing; Terminal Position: DUAL; Reach SVHC Compliant: Yes; RoHS Compliant: Yes; ComponentLink1URL: https://datasheet.ciiva.com:443/pdfs/VipMasterIC/IC/SEMT/SEMT-S-A0000305255/SEMT-S-A0000305255-1.pdf?src-supplier=IHS+Markit; ComponentLink1Description: https://datasheet.ciiva.com:443/pdfs/VipMasterIC/IC/SEMT/SEMT-S-A0000305255/SEMT-S-A0000305255-1.pdf?src-supplier=IHS+Markit; ComponentLink2URL: https://datasheet.ciiva.com/338/smf05c-338385.pdf?src-supplier=Digikey; ComponentLink2Description: https://datasheet.ciiva.com/338/smf05c-338385.pdf?src-supplier=Digikey; ComponentLink3URL: https://datasheet.ciiva.com/18065/getdatasheetpartid-89007-18065142.pdf?src-supplier=Verical; ComponentLink3Description: https://datasheet.ciiva.com/18065/getdatasheetpartid-89007-18065142.pdf?src-supplier=Verical; ComponentLink4URL: https://datasheet.ciiva.com/338/smf05c-338386.pdf?src-supplier=Digikey; ComponentLink4Description: https://datasheet.ciiva.com/338/smf05c-338386.pdf?src-supplier=Digikey; ComponentLink5URL: https://datasheet.ciiva.com/338/smf05c-338387.pdf?src-supplier=Digikey; ComponentLink5Description: https://datasheet.ciiva.com/338/smf05c-338387.pdf?src-supplier=Digikey; ComponentLink6URL: https://datasheet.ciiva.com/16387/smf05c-16387308.pdf?src-supplier=Future+Electronics; ComponentLink6Description: https://datasheet.ciiva.com/16387/smf05c-16387308.pdf?src-supplier=Future+Electronics
U103 = TPS7A0233DQNR: IC REG LINEAR 3V3 200MA 4X2SON; Supplier 1: Mouser; Supplier Part Number 1: 595-TPS7A0233DQNR
U104 = BQ24297RGER: Power Supply Management Circuit, Adjustable, 1 Channel, +6.4V, PQCC24; Manufacturer: Texas Instruments; Package Body Material: Plastic; Adjustable Threshold: Yes; Number of Channels: 1; Package Equivalence Code: LCC24,.16SQ,20; Power Supplies: 3.9/6.2V; Supply Current-Max (Isup): 3A; Max Supply Voltage: 6.2V; Min Supply Voltage: 3.9V; Nominal Supply Voltage: 5V; Qualification Status: Not Qualified; Supplier 1: Digikey; Supplier Part Number 1: 296-46072-1-ND; Supplier: Digikey; Supplier Part Number: 296-46072-1-ND; Manufacturer Part Number: BQ24297RGER; RoHS: Yes; Category: Battery Management; Stock: 17491; Pricing: 1=2.71, 10=2.433, 25=2.3004, 100=1.9937, 250=1.89144, 500=1.8 (USD); Case/Package: HVQCCN; Pins: 24; Package Shape: Square; Terminal Finish: Nickel; Min Operating Temperature: -40°C; Max Operating Temperature: 85°C; JESD-609 Code: e4; Throw Configuration: POWER SUPPLY MANAGEMENT CIRCUIT; Moisture Sensitivity Level: 2; Channels: 1; Package Style: CHIP CARRIER, HEAT SINK/SLUG, VERY THIN PROFILEMeter; Peak Reflow Temperature (Cel): 260°C; Surface Mount: Yes; Terminal Form: No Lead; Terminal Position: QUAD; Length: 4mm; Width: 4mm; Height - Seated (Max): 1mm; Terminal Pitch: 0.5mm; Temperature Grade: INDUSTRIAL; Reach SVHC Compliant: Yes; RoHS Compliant: Yes; ComponentLink1URL: https://www.ti.com:443/lit/ds/symlink/bq24296.pdf?src-supplier=IHS+Markit; ComponentLink1Description: https://www.ti.com:443/lit/ds/symlink/bq24296.pdf?src-supplier=IHS+Markit; ComponentLink2URL: https://datasheet.ciiva.com/30000/bq24296-30000397.pdf?src-supplier=Avnet; ComponentLink2Description: https://datasheet.ciiva.com/30000/bq24296-30000397.pdf?src-supplier=Avnet
U105 = LMC555CTPX/NOPB: 1 Func, 3MHz, CMOS, PBGA8; Manufacturer: TI National Semiconductor; Package Body Material: Plastic; Throw Configuration: PULSE; RECTANGULAR; Channels: 1; Output Frequency-Max: 3GHz; Power Supplies: 1.5/12V; Max Supply Voltage: 12V; Min Supply Voltage: 1.5V; Nominal Supply Voltage: 5V; Time @ Peak Reflow Temperature-Max (s): 40s; Qualification Status: Not Qualified; Supplier 1: Digikey; Supplier Part Number 1: 296-46430-1-ND; Supplier: Digikey; Supplier Part Number: 296-46430-1-ND; Manufacturer Part Number: LMC555CTPX/NOPB; RoHS: Yes; Category: Timers and Oscillators; Stock: 27881; Pricing: 1=1.35, 10=1.204, 25=1.1424, 100=0.9385, 250=0.87728, 500=0.77528, 1000=0.61206 (USD); Case/Package: FBGA; Pins: 8; Package Shape: Rectangular; Terminal Finish: Copper; Min Operating Temperature: -40°C; Max Operating Temperature: 85°C; JESD-609 Code: e1; Moisture Sensitivity Level: 1; Package Style: GRID ARRAY, FINE PITCHMeter; Peak Reflow Temperature (Cel): 260°C; Surface Mount: Yes; Technology: CMOS; Terminal Form: Ball; Terminal Position: BOTTOM; Length: 1.412mm; Width: 1.387mm; Terminal Pitch: 0.5mm; Reach SVHC Compliant: Yes; RoHS Compliant: Yes; Temperature Grade: INDUSTRIAL; ComponentLink1URL: https://datasheet.ciiva.com:443/pdfs/VipMasterIC/IC/NATL/NATLS11844/NATLS11844-1.pdf?src-supplier=IHS+Markit; ComponentLink1Description: https://datasheet.ciiva.com:443/pdfs/VipMasterIC/IC/NATL/NATLS11844/NATLS11844-1.pdf?src-supplier=IHS+Markit; ComponentLink2URL: https://datasheet.ciiva.com/6666/lmc555-6666976.pdf?src-supplier=Digikey; ComponentLink2Description: https://datasheet.ciiva.com/6666/lmc555-6666976.pdf?src-supplier=Digikey; ComponentLink3URL: https://datasheet.ciiva.com/15152/getdatasheetpartid-628891-15152597.pdf?src-supplier=Verical; ComponentLink3Description: https://datasheet.ciiva.com/15152/getdatasheetpartid-628891-15152597.pdf?src-supplier=Verical; ComponentLink4URL: https://datasheet.ciiva.com/14274/lmc555-14274486.pdf?src-supplier=Avnet; ComponentLink4Description: https://datasheet.ciiva.com/14274/lmc555-14274486.pdf?src-supplier=Avnet; ComponentLink5URL: https://datasheet.ciiva.com/14274/lmc555-14274422.pdf?src-supplier=Avnet; ComponentLink5Description: https://datasheet.ciiva.com/14274/lmc555-14274422.pdf?src-supplier=Avnet